# Altium schematic sheet CSI2-KRIA-KV260_Rev01-2.SchDoc: CSI2-KRIA-KV260_Rev01
size A3; PageSetup: Record=PageOptions|CenterHorizontal=True|CenterVertical=True|PrintScale=0.73|XCorrection=1.00|YCorrection=1.00|PrintKind=2|BorderSize=5000000|LeftOffset=0|BottomOffset=0|Orientation=2|PaperLength=1000|PaperWidth=1000|Scale=100|PaperSource=7|PrintQuality=-4|MediaType=1|DitherType=10|PrintScaleMode=1|PaperKind=A3; CheckedBy: IHA; Author: CWA; CompanyName: Allied Vision Technologies GmbH; Address1: Taschenweg 2a; Address2: 07646 Stadtroda; Address3: Germany; Revision: 01; SheetNumber: 2; SheetTotal: 2
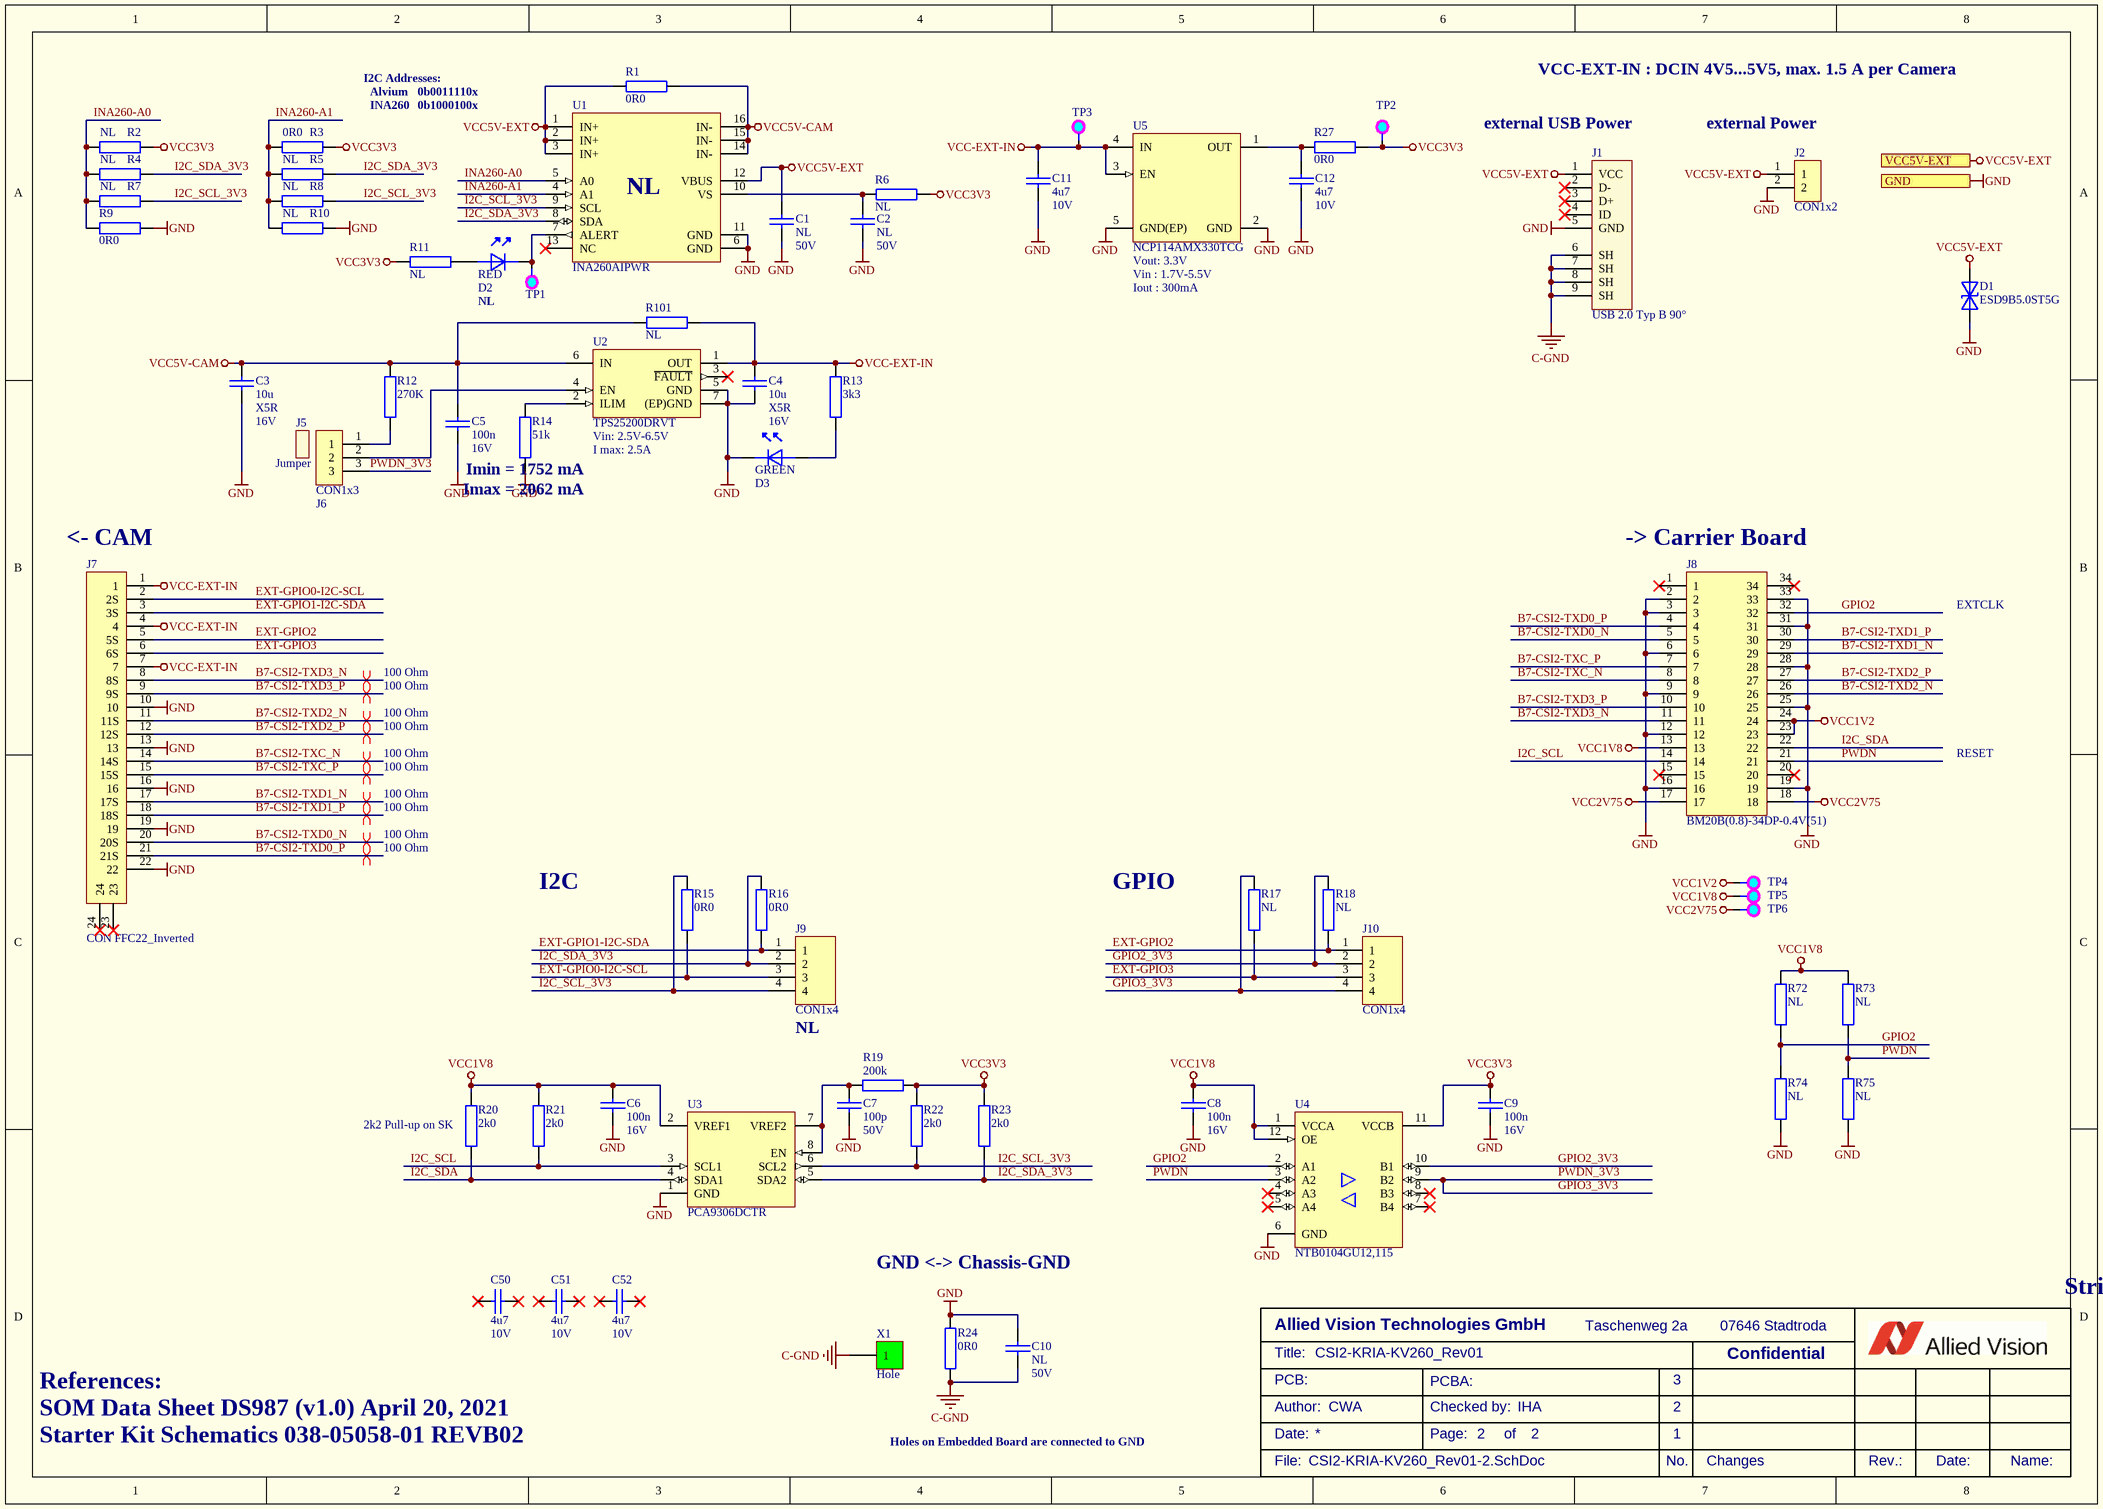
[diagram p0: CSI2-KRIA-KV260_Rev01-2.SchDoc]

## Parts
C1  NL  Voltage: 50V  [C-0402_0.55]
C2  NL  Voltage: 50V  [C-0402_0.55]
C3  10u  Dielectric: X5R  Voltage: 16V  [C-0805_1.4]
C4  10u  Dielectric: X5R  Voltage: 16V  [C-0805_1.4]
C5  100n  Voltage: 16V  [C-0402_0.55]
C6  100n  Voltage: 16V  [C-0402_0.55]
C7  100p  Voltage: 50V  [C-0402_0.55]
C8  100n  Voltage: 16V  [C-0402_0.55]
C9  100n  Voltage: 16V  [C-0402_0.55]
C10  NL  Voltage: 50V  [C-0603_1.0]
C11  4u7  Voltage: 10V  [C-0603_1.0]
C12  4u7  Voltage: 10V  [C-0603_1.0]
C50  4u7  Voltage: 10V  [C-0603_1.0]
C51  4u7  Voltage: 10V  [C-0603_1.0]
C52  4u7  Voltage: 10V  [C-0603_1.0]
D1  ESD9B5.0ST5G  [D-SOD923]
D2  RED  [D-0603-LED]
D3  GREEN  [D-0603-LED]
J1  USB 2.0 Typ B 90°  [J-629105150521]
J2  CON1x2  [CON 1x2 RM2.54]
J5  Jumper  [J-JUMPER-2.54]
J6  CON1x3  [CON 1x3 RM2.54]
J7  CON FFC22_Inverted  [J-FH55-22S-0.5SH - Inverted Pins]
J8  BM20B(0.8)-34DP-0.4V(51)  [J-BM20B(0.8)-34DP]
J9  CON1x4  [CON 1x4 RM2.54]
J10  CON1x4  [CON 1x4 RM2.54]
R1  0R0  [R-0603_0.6]
R2  NL  [R-0603_0.6]
R3  0R0  [R-0603_0.6]
R4  NL  [R-0603_0.6]
R5  NL  [R-0603_0.6]
R6  NL  [R-0603_0.6]
R7  NL  [R-0603_0.6]
R8  NL  [R-0603_0.6]
R9  0R0  [R-0603_0.6]
R10  NL  [R-0603_0.6]
R11  NL  [R-0402_0.4]
R12  270K  [R-0402_0.4]
R13  3k3  [R-0402_0.4]
R14  51k  [R-0402_0.4]
R15  0R0  [R-0603_0.6]
R16  0R0  [R-0603_0.6]
R17  NL  [R-0603_0.6]
R18  NL  [R-0603_0.6]
R19  200k  [R-0402_0.4]
R20  2k0  [R-0402_0.4]
R21  2k0  [R-0402_0.4]
R22  2k0  [R-0402_0.4]
R23  2k0  [R-0402_0.4]
R24  0R0  [R-0603_0.6]
R27  0R0  [R-0603_0.6]
R72  NL  [R-0603_0.6]
R73  NL  [R-0603_0.6]
R74  NL  [R-0603_0.6]
R75  NL  [R-0603_0.6]
R101  NL  [R-0603_0.6]
TP1  TP  [TP_16_10]  (value not drawn)  (no BOM)
TP2  TP  [TP_16_10]  (value not drawn)  (no BOM)
TP3  TP  [TP_16_10]  (value not drawn)  (no BOM)
TP4  TP  [TP_16_10]  (value not drawn)  (no BOM)
TP5  TP  [TP_16_10]  (value not drawn)  (no BOM)
TP6  TP  [TP_16_10]  (value not drawn)  (no BOM)
U1  INA260AIPWR  [IC-TSSOP16 6.4x5.1x1.2]
U2  TPS25200DRVT  Vin: 2.5V-6.5V  I max: 2.5A  [IC-DFN06_2.0x2.0x0.8]
U3  PCA9306DCTR  [IC-TSSOP8_3.15x4.25x1.3]
U4  NTB0104GU12,115  [IC-XQFN12_1.7x2x0.5]
U5  NCP114AMX330TCG  Vout: 3.3V  Vin: Vin : 1.7V-5.5V  Iout: Iout : 300mA  [IC-XDFN4_1.0x1.0x0.6]
X1  Hole  [HOLE-3.4-6.0-DK]  (no BOM)

## Ports
GND, VCC5V-EXT

## Nets
C-GND: C10.2 J1.6(SH) J1.7(SH) J1.8(SH) J1.9(SH) R24.1 X1.1
GND: C1.2 C2.2 C3.2 C4.2 C5.2 C6.2 C7.2 C8.2 C9.2 C10.1 C11.2 C12.2 D1.A D3.K J1.5(GND) J2.2 J7.10 J7.13 J7.16 J7.19 J7.22 J8.2 J8.3 J8.6 J8.9 J8.12 J8.16 J8.19 J8.25 J8.28 J8.31 J8.33 R9.1 R10.1 R14.1 R24.2 R74.1 R75.1 U1.6(GND) U1.11(GND) U2.5(GND) U2.7((EP)GND) U3.1(GND) U4.6(GND) U5.2(GND) U5.5(GND(EP)) ; port GND
VCC1V2: J8.23 J8.24 TP4.1
VCC1V8: C6.1 C8.1 J8.13 R20.1 R21.1 R72.2 R73.2 TP5.1 U3.2(VREF1) U4.1(VCCA) U4.12(OE)
VCC2V75: J8.17 J8.18 TP6.1
VCC3V3: C9.1 R2.1 R3.1 R6.1 R11.1 R19.2 R22.2 R23.2 R27.2 TP2.1 U4.11(VCCB)
VCC5V-CAM: C3.1 C5.1 R1.1 R12.1 R101.2 U1.14(IN-) U1.15(IN-) U1.16(IN-) U2.6(IN)
VCC5V-EXT: C1.1 D1.K J1.1(VCC) J2.1 R1.2 U1.1(IN+) U1.2(IN+) U1.3(IN+) U1.12(VBUS) ; port VCC5V-EXT
VCC-EXT-IN: C4.1 C11.1 J7.1 J7.4 J7.7 R13.1 R101.1 TP3.1 U2.1(OUT) U5.3(EN) U5.4(IN)
B7-CSI2-TXC_N: J7.14(14S) J8.8
B7-CSI2-TXC_P: J7.15(15S) J8.7
B7-CSI2-TXD0_N: J7.20(20S) J8.5
B7-CSI2-TXD0_P: J7.21(21S) J8.4
B7-CSI2-TXD1_N: J7.17(17S) J8.29
B7-CSI2-TXD1_P: J7.18(18S) J8.30
B7-CSI2-TXD2_N: J7.11(11S) J8.26
B7-CSI2-TXD2_P: J7.12(12S) J8.27
B7-CSI2-TXD3_N: J7.8(8S) J8.11
B7-CSI2-TXD3_P: J7.9(9S) J8.10
EXT-GPIO0-I2C-SCL: J7.2(2S) J9.3 R15.1
EXT-GPIO1-I2C-SDA: J7.3(3S) J9.1 R16.1
EXT-GPIO2: J7.5(5S) J10.1 R18.1
EXT-GPIO3: J7.6(6S) J10.3 R17.1
GPIO2: J8.32 R72.1 R74.2 U4.2(A1)
GPIO2_3V3: J10.2 R18.2 U4.10(B1)
GPIO3_3V3: J6.3 J10.4 R17.2 U4.9(B2)  [also labelled PWDN_3V3]
I2C_SCL: J8.14 R21.2 U3.3(SCL1)
I2C_SCL_3V3: J9.4 R7.1 R8.1 R15.2 R22.1 U1.9(SCL) U3.6(SCL2)
I2C_SDA: J8.22 R20.2 U3.4(SDA1)
I2C_SDA_3V3: J9.2 R4.1 R5.1 R16.2 R23.1 U1.8(SDA) U3.5(SDA2)
INA260-A0: R2.2 R4.2 R7.2 R9.2 U1.5(A0)
INA260-A1: R3.2 R5.2 R8.2 R10.2 U1.4(A1)
PWDN: J8.21 R73.1 R75.2 U4.3(A2)
NetC2_1: C2.1 R6.2 U1.10(VS)
NetC7_1: C7.1 R19.1 U3.7(VREF2) U3.8(EN)
NetC12_1: C12.1 R27.1 U5.1(OUT)
NetD2_A: D2.A R11.2
NetD2_K: D2.K TP1.1 U1.7(ALERT)
NetD3_A: D3.A R13.2
NetJ6_1: J6.1 R12.2
NetJ6_2: J6.2 U2.4(EN)
NetR14_2: R14.2 U2.2(ILIM)

Not connected (* = marked no-connect by the designer): C50 1* 2*; C51 1* 2*; C52 1* 2*; J1 2(D-)* 3(D+)* 4(ID)*; J7 23* 24*; J8 1* 15* 20* 34*; U1 13(NC)*; U2 3(~{FAULT})*; U4 4(A3)* 5(A4)* 7(B4)* 8(B3)*

## Layout directives
differential pair; net class 100 Ohm; rule Matched Net Lengths [Tolerance = 0.05mm]: B7-CSI2-TXC_N, B7-CSI2-TXC_P, B7-CSI2-TXD0_N, B7-CSI2-TXD0_P, B7-CSI2-TXD1_N, B7-CSI2-TXD1_P, B7-CSI2-TXD2_N, B7-CSI2-TXD2_P, B7-CSI2-TXD3_N, B7-CSI2-TXD3_P

## Notes on the sheet
- I2C Addresses:
- Alvium
- INA260
- 0b0011110x
- 0b1000100x
- VCC-EXT-IN : DCIN 4V5...5V5, max. 1.5 A per Camera
- (near J1) external USB Power
- (near J2) external Power
- (near U1) NL
- NL
- Imin = 1752 mA
- Imax = 2062 mA
- (near J7) <- CAM
- (near J8) -> Carrier Board
- EXTCLK
- RESET
- I2C
- GPIO
- (near J9) NL
- (near R20) 2k2 Pull-up on SK
- GND <-> Chassis-GND
- Strict Hierarchical Design (Power Ports local)
- References:
- SOM Data Sheet DS987 (v1.0) April 20, 2021
- Starter Kit Schematics 038-05058-01 REVB02
- Holes on Embedded Board are connected to GND
- Title:
- PCB:
- PCBA:
- 3
- Confidential
- Author:
- Date:
- Checked by:
- Page:
- of
- 1
- 2
- File:
- No.
- Changes
- Rev.:
- Name:

## Library data of the parts
C1 C2 = C X 0402: Capacitor Ceramic SMD/0402/50V/X7R/10%; Manufacturer: several; Dielectric: X7R; Tolerance: 10%; Manufacturer Part Number: several
C3 C4 = C 10U 16V X5R 0805: Capacitor Ceramic SMD/0805/16V/X5R/10%; KHK Part Number: K8340151; Manufacturer: several; Tolerance: 10%; Manufacturer Part Number: several; Supplier 1: Digi-Key; Supplier Part Number 1: 478-5165-1-ND
C5 C6 C8 C9 = C 100N 10% 16V X7R 402: Capacitor Ceramic SMD/0402/16V/X7R/10%; KHK Part Number: K8340114; Manufacturer: several; Dielectric: X7R; Tolerance: 10%; Manufacturer Part Number: several; Supplier 1: Digi-Key; Supplier 2: Digi-Key; Supplier Part Number 1: 1276-1508-1-ND; Supplier Part Number 2: 311-1338-1-ND
C7 = C 100P 50V X7R 0402: Capacitor Ceramic SMD/0402/50V/X7R/10%; KHK Part Number: K8340145; Manufacturer: several; Dielectric: X7R; Tolerance: 10%; Manufacturer Part Number: several; Supplier 1: Digi-Key; Supplier Part Number 1: 478-1089-1-ND
C10 = C X 0603: Capacitor Ceramic SMD/0603/50V/X7R/10%; Manufacturer: several; Dielectric: X7R; Tolerance: 10%; Manufacturer Part Number: several
C11 C12 C50-C52 = C 4U7 10V X5R 0603: Capacitor Ceramic SMD/0603/10V/X5R/10%; KHK Part Number: 1431; Manufacturer: several; Dielectric: X5R; Tolerance: 10%; Manufacturer Part Number: several; Supplier 1: Digi-Key; Supplier Part Number 1: 399-9100-1-ND
D1 = D ESD9B5.0ST5G: DIODE TVS; 400W; 5.8-7.8V; BIDIRECT; KHK Part Number: 7250; Manufacturer: ON Semiconductor; Manufacturer Part Number: ESD9B5.0ST5G; Supplier 1: Digi-Key; Supplier Part Number 1: ESD9B5.0ST5GOSCT-ND
D2 = D LED 0603 red: Chip LED red 250mcd; KHK Part Number: 8145; Manufacturer: Würth; Manufacturer Part Number: 150060RS75000; Current: 20mA; Color: red; Supplier 1: Digi-Key; Supplier Part Number 1: 732-4978-1-ND
D3 = D LED 0603 green: Chip LED green 430mcd; KHK Part Number: 8172; Manufacturer: Würth; Manufacturer Part Number: 150060GS75000; Current: 20mA; Color: green; Supplier 1: Digi-Key; Supplier Part Number 1: 732-4971-1-ND
J1 = CON USB 2.0 Typ B 90°: Micro USB 2.0 Typ B 90°; KHK Part Number: 14360; Manufacturer: WE; Manufacturer Part Number: 629 105 150 521; Supplier 1: Digi-Key; Supplier Part Number 1: 732-5960-1-ND
J2 = CON 1x2 2.54 several: Header Vertical, 1x2 Pos, Pitch 2.54mm, Contact Length Mating 6.00mm, Contact Length Post 3.00mm, Insulation Height 2.54mm, Gold Plating; KHK Part Number: 15337; Manufacturer: several; Manufacturer Part Number: several; Supplier 1: Digi-Key; Supplier Part Number 1: 732-5315-ND
J5 = CON Jumper 2.54mm: CON/JUMPER/STC02SYAN; 2-pin; 2.54mm; 3A; FEMALE; VERTICAL; BLACK; KHK Part Number: 13444; Manufacturer: several; Manufacturer Part Number: several; Supplier 1: Digi-Key; Supplier Part Number 1: S9000-ND
J6 = CON 1x3 2.54 several: Header Vertical, 1x3 Pos, Pitch 2.54mm, Contact Length Mating 6.00mm, Contact Length Post 3.00mm, Insulation Height 2.54mm, Gold Plating; KHK Part Number: 15338; Manufacturer: several; Manufacturer Part Number: several; Supplier 1: Digi-Key; Supplier Part Number 1: 732-5316-ND
J7 = CON FFC22_FH55-22S-0.5SH_Inverted: FFC Connector 0.5mm shielded; KHK Part Number: 10357; Manufacturer: Hirose; Manufacturer Part Number: FH55-22S-0.5SH; Supplier 1: Mouser; Supplier Part Number 1: 798-FH55-22S-0.5SH
J8 = CON BM20B(0.8)-34DP: CON/B2B/BM20B;34-pin;0.4;SMT;HEADER;VERTICAL; Manufacturer: HiRose; KHK Part Number: 18690; Manufacturer Part Number: BM20B(0.8)-34DP-0.4V(51)
J9 J10 = CON 1x4 2.54 several: Header Vertical, 1x4 Pos, Pitch 2.54mm, Contact Length Mating 6.00mm, Contact Length Post 3.00mm, Insulation Height 2.54mm, Gold Plating; KHK Part Number: 15343; Manufacturer: several; Manufacturer Part Number: several; Supplier 1: Digi-Key; Supplier Part Number 1: 732-5317-ND
R1 R3 R9 R15 R16 R24 = R 0R0 1% 0603: Standard Resistor SMD/0603/1%/100mW/TK200; KHK Part Number: K8250041; Manufacturer: several; Tolerance: 1%; Manufacturer Part Number: several; Temperature Coefficient: *; Supplier 1: Digi-Key; Supplier Part Number 1: 311-0.0HRCT-ND
R2 R4 R5 R7 R8 R10 R17 R18 R72-R75 R101 = R X 0603: Standard Resistor SMD/0603/1%/100mW/TK200; Temperature Coefficient: TK100; Tolerance: 1%
R6 = R X 0603: Standard Resistor SMD/0603/1%/100mW/TK200; Tolerance: 1%; Temperature Coefficient: TK100
R11 = R X 0402: Standard Resistor SMD/0402/1%/63mW/TK200; Tolerance: 1%; Temperature Coefficient: TK100
R12 = R 270K 1% 0402: Standard Resistor SMD/0402/1%/63mW/TK100; KHK Part Number: 3875; Manufacturer: several; Tolerance: 1%; Temperature Coefficient: TK100; Manufacturer Part Number: several; Supplier 1: Digi-Key; Supplier Part Number 1: CR0402-FX-2703GLFCT-ND
R13 = R 3k3 1% 0402: Standard Resistor SMD/0402/1%/63mW/TK100; KHK Part Number: K8250347; Manufacturer: several; Tolerance: 1%; Temperature Coefficient: TK100; Manufacturer Part Number: several; Supplier 1: Digi-Key; Supplier Part Number 1: 311-3.30KLRCT-ND
R14 = R 51K 1% 0402: Standard Resistor SMD/0402/1%/63mW/TK100; KHK Part Number: K8250273; Manufacturer: several; Tolerance: 1%; Temperature Coefficient: TK100; Manufacturer Part Number: several; Supplier 1: Digi-Key; Supplier Part Number 1: 311-51.0KLRCT-ND
R19 = R 200K 1% 0402: Standard Resistor SMD/0402/1%/63mW/TK100; KHK Part Number: K8250280; Manufacturer: several; Temperature Coefficient: TK100; Tolerance: 1%; Manufacturer Part Number: several; Supplier 1: Digi-Key; Supplier 2: Arrow; Supplier 3: Arrow; Supplier Part Number 1: 311-200KLRCT-ND; Supplier Part Number 2: CRCW0402200KFKED; Supplier Part Number 3: NRC04F2003TRF
R20-R23 = R 2k0 1% 0402: Standard Resistor SMD/0402/1%/63mW/TK100; KHK Part Number: K8250311; Manufacturer: several; Temperature Coefficient: TK100; Tolerance: 1%; Manufacturer Part Number: several; Supplier 1: Digi-Key; Supplier Part Number 1: 311-2KLRCT-ND
R27 = R 0R0 1% 0603: Standard Resistor SMD/0603/1%/100mW/TK100; KHK Part Number: K8250041; Manufacturer: several; Tolerance: 1%; Manufacturer Part Number: several; Temperature Coefficient: *
TP1-TP6 = TP_16_10: Testpoint: Pad=1,6mm; Hole=1,0mm
U1 = IC INA260: IC/PWR/CURR SHUNT MONITOR/2.7-5.5V;4.5mR/TSSOP16/5.0x4.4x1.2mm; KHK Part Number: 16206; Manufacturer: TI; Manufacturer Part Number: INA260AIPWR; Supplier 1: Digi-Key; Supplier Part Number 1: 296-47777-1-ND
U2 = IC  TPS25200DRVT: IC/PWR/LOADSW;2V5-6V5;2A5;0R099/6-WDFN/2x2x0.8mm; KHK Part Number: 14277; Manufacturer: Texas Instruments; Manufacturer Part Number: TPS25200DRVT; Supplier 1: Digi-Key; Supplier Part Number 1: 296-37760-1-ND
U3 = IC PCA9306DCTR: IC/LOGIC/LEVELSHIFTER;I2C;AUTO-DIR;1V2-5V/SSOP-8/4.25x3.15x1.3mm; KHK Part Number: 9555; Manufacturer: TI; Manufacturer Part Number: PCA9306DCTR; Supplier 1: Digi-Key; Supplier Part Number 1: 296-18509-1-ND
U4 = IC NTB0104GU12,115: IC/LOGIC/Levelshifter;Auto-Dir;Bidirectional;Push-Pull;-40-+125°C/; Manufacturer: NXP; KHK Part Number: 14383; Manufacturer Part Number: NTB0104GU12,115; Supplier 1: Digi-Key; Supplier Part Number 1: 568-5204-1-ND
U5 = IC NCP114AMX330TCG: IC/PWR/LDO;1V7-5V5;3V3;0A3/XDFN4/1x1x0.6mm; KHK Part Number: 20303; Manufacturer: ON Semi; Manufacturer Part Number: NCP114AMX330TCG
X1 = PCB HOLE 3.4-6-DK: HOLE 3.4-6-M3 Alternative